# Altium project bms_mainboard-1_1.PrjPcb (part 4 of 8)

## Sheet conn_fan.SchDoc
size A
Used 2 times, as channels fan0, fan1. Parts and nets are listed once, with the designators drawn on the sheet.
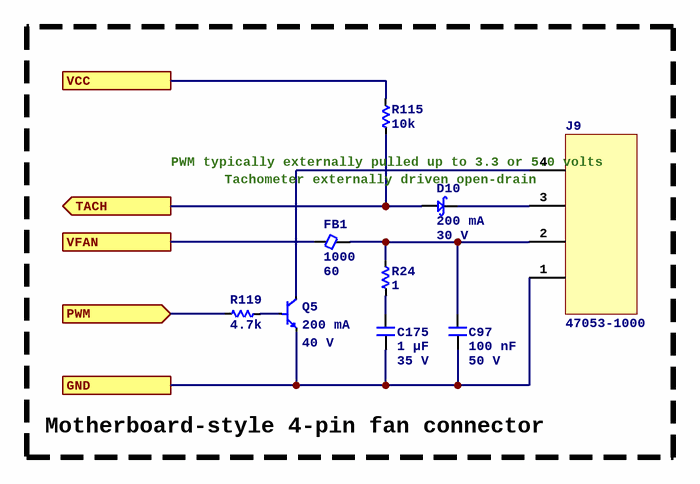
[diagram p19: conn_fan.SchDoc]

### Parts
C97  Capacitance: 100 nF  Voltage Rating: 50 V  [C0402]  (hidden comment: CL05B104KB54PNC)
C175  Capacitance: 1 µF  Voltage Rating: 35 V  [C0603]  (hidden comment: GMK107AB7105KAHT)
D10  Current: 200 mA  Vr: 30 V  [SOD523]  (hidden comment: BAT54XV2T1G)
FB1  Current Rating (mA): 1000  Z @ 100 MHz: 60  [FB0805]  (hidden comment: MGGB2012M600HT-LF)
J9  47053-1000  [MOLEX_KK254_4POS_VERT_0470531000]
Q5  Current: 200 mA  Voltage: 40 V  [3SOT523]  (hidden comment: MMBT3904T)
R24  value 1  [R0402]  (hidden comment: CRCW04021R00FKEDC)
R115  value 10k  [R0402]  (hidden comment: 0402WGF1002TCE)
R119  value 4.7k  [R0402]  (hidden comment: 0402WGF4701TCE)

### Ports
GND, PWM (in), TACH (out), VCC, VFAN

### Nets
GND: C97.2 C175.2 J9.1 Q5.2(E) ; port GND
PWM: R119.2 ; port PWM
TACH: D10.1 R115.2 ; port TACH
VCC: R115.1 ; port VCC
VFAN: FB1.1 ; port VFAN
NetC97_1: C97.1 FB1.2 J9.2 R24.2
NetC175_1: C175.1 R24.1
NetD10_2: D10.2 J9.3
NetJ9_4: J9.4 Q5.3(C)
NetQ5_1: Q5.1(B) R119.1

### Channels
fan0: designators end in A; ports GND=GND PWM=FAN1_PWM TACH=FAN1_TACH VCC=3P3 VFAN=LV2
fan1: designators end in B; ports GND=GND PWM=FAN2_PWM TACH=FAN2_TACH VCC=3P3 VFAN=LV2

### Notes on the sheet
- PWM typically externally pulled up to 3.3 or 5.0 volts
- (near D10) Tachometer externally driven open-drain
- Motherboard-style 4-pin fan connector

### Library data of the parts
C97 = CL05B104KB54PNC: Manufacturer: Samsung Electro-Mechanics; Dielectric: X7R; ComponentLink1URL: https://wmsc.lcsc.com/wmsc/upload/file/pdf/v2/lcsc/2304140030_Samsung-Electro-Mechanics-CL05B104KB54PNC_C307331.pdf; ComponentLink1Description: Datasheet; Manufacturer Part Number: CL05B104KB54PNC; Package: 0402; Supplier 2: LCSC; Supplier Part Number 2: C307331
C175 = GMK107AB7105KAHT: Manufacturer: Taiyo Yuden; Dielectric: X7R; ComponentLink1URL: https://datasheet.lcsc.com/lcsc/2304140030_Taiyo-Yuden-GMK107AB7105KAHT_C841050.pdf; ComponentLink1Description: Datasheet; Manufacturer Part Number: GMK107AB7105KAHT; Package: 0603; Supplier 2: LCSC; Supplier Part Number 2: C841050
D10 = BAT54XV2T1G: ON Semi BAT54XV2T1G; SMT Schottky Diode; 30V 200mA; 5ns; 2-Pin SOD-523; Manufacturer: onsemi; Supplier 1: DigiKey; Supplier Part Number 1: BAT54XV2T1GOSCT-ND; Manufacturer Part Number: BAT54XV2T1G; Supplier 2: LCSC; Supplier Part Number 2: C81572; ComponentLink1Description: Datasheet; ComponentLink1URL: https://www.onsemi.com/pdf/datasheet/bat54xv2t1-d.pdf; Diode Type: Schottky; Supplier 3: Mouser; Supplier Part Number 3: 863-BAT54XV2T1G
FB1 = MGGB2012M600HT-LF: Manufacturer: microgate; DCR (mOhms): 50; ComponentLink1URL: https://wmsc.lcsc.com/wmsc/upload/file/pdf/v2/lcsc/2304140030_microgate-MGGB2012M600HT-LF_C281169.pdf; ComponentLink1Description: Datasheet; Manufacturer Part Number: MGGB2012M600HT-LF; Package: 0805; Supplier 2: LCSC; Supplier Part Number 2: C281169
J9 = 47053-1000: Board Connector, 4 Contact(s), 1 Row(s), Male, Straight, 0.1 inch Pitch, Solder Terminal, Locking, White Insulator, Receptacle; Manufacturer: Molex; Supplier 1: DigiKey; Supplier Part Number 1: WM4330-ND; Manufacturer Part Number: 47053-1000; ComponentLink1URL: https://www.molex.com/content/dam/molex/molex-dot-com/products/automated/en-us/salesdrawingpdf/470/47053/470531000_sd.pdf?inline; ComponentLink1Description: Drawing; ComponentLink2Description: Product page; ComponentLink2URL: https://www.molex.com/en-us/products/part-detail/470531000; Supplier 2: LCSC; Supplier Part Number 2: C240840; Supplier 3: Mouser; Supplier Part Number 3: 538-47053-1000
Q5 = MMBT3904T: Bipolar (BJT) Transistor NPN 40 V 200 mA 300MHz 150 mW Surface Mount SOT-523; Manufacturer: Shenzhen Slkormicro Semicon Co., Ltd.; Supplier 1: DigiKey; Supplier Part Number 1: 5399-MMBT3904TCT-ND; Manufacturer Part Number: MMBT3904T; ComponentLink1Description: Datasheet; ComponentLink1URL: https://mm.digikey.com/Volume0/opasdata/d220001/medias/docus/7136/5399_MMBT3904T%20SOT-523.pdf; Supplier 2: LCSC; Supplier Part Number 2: C61616; Polarity: NPN
R24 = CRCW04021R00FKEDC: Manufacturer: Vishay Intertech; Tolerance: 1%; Temperature Coefficient: ±100ppm/?; Power Rating (mW): 62.5; ComponentLink1Description: Datasheet; ComponentLink1URL: https://datasheet.lcsc.com/lcsc/2304140030_Vishay-Intertech-CRCW04021R00FKEDC_C2077765.pdf; Manufacturer Part Number: CRCW04021R00FKEDC; Package: 0402; Supplier 2: LCSC; Supplier Part Number 2: C2077765
R115 = 0402WGF1002TCE: Manufacturer: UNI-ROYAL(Uniroyal Elec); Tolerance: 1%; Temperature Coefficient: ±100ppm/?; Power Rating (mW): 62.5; ComponentLink1Description: Datasheet; ComponentLink1URL: https://wmsc.lcsc.com/wmsc/upload/file/pdf/v2/lcsc/2206010100_UNI-ROYAL-Uniroyal-Elec-0402WGF1002TCE_C25744.pdf; Manufacturer Part Number: 0402WGF1002TCE; Package: 0402; Supplier 2: LCSC; Supplier Part Number 2: C25744
R119 = 0402WGF4701TCE: Manufacturer: UNI-ROYAL(Uniroyal Elec); Tolerance: 1%; Temperature Coefficient: ±100ppm/?; Power Rating (mW): 62.5; ComponentLink1Description: Datasheet; ComponentLink1URL: https://wmsc.lcsc.com/wmsc/upload/file/pdf/v2/lcsc/2206010045_UNI-ROYAL-Uniroyal-Elec-0402WGF4701TCE_C25900.pdf; Manufacturer Part Number: 0402WGF4701TCE; Package: 0402; Supplier 2: LCSC; Supplier Part Number 2: C25900

## Sheet hv_bleed.SchDoc
size A
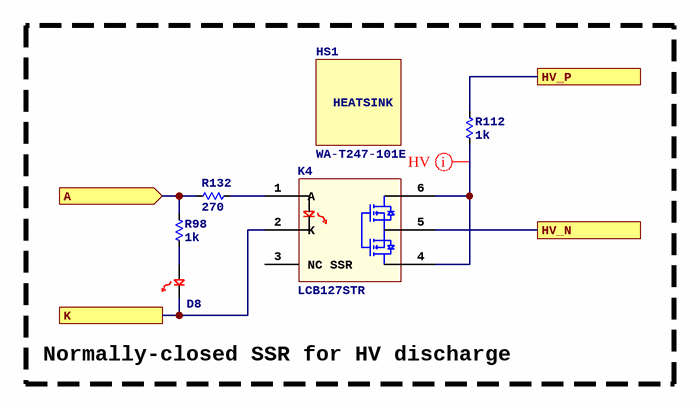
[diagram p20: hv_bleed.SchDoc]

### Parts
D8  LTST-C190KRKT  [LED_0603P_RED]  (value not drawn)
HS1  WA-T247-101E  [OHMITE_WA-T247-101E]
K4  LCB127STR  [6SMD300]
R98  value 1k  [R0402]  (hidden comment: 0402WGF1001TCE)
R112  value 1k  [TO-247-2_VERTICAL]  (hidden comment: TEH100M1K00JE)
R132  value 270  [R0402]  (hidden comment: 0402WGF2700TCE)

### Blocks framed on the sheet
Normally-closed SSR for HV discharge: D8 HS1 K4 R98 R112 R132

### Ports
A (in), HV_N, HV_P, K

### Nets
GND: D8.2 K4.2(K) ; port K
HV_N: K4.5 ; port HV_N
HV_P: R112.2 ; port HV_P
HV_nBLEED: R98.1 R132.2 ; port A
NetD8_1: D8.1 R98.2
NetK4_1: K4.1(A) R132.1
NetK4_4: K4.4 K4.6 R112.1

Not connected (* = marked no-connect by the designer): K4 3

### Layout directives
net class HV: NetK4_4

### Notes on the sheet
- (in symbol LCB127STR) NC SSR
- (in symbol WA-T247-101E) HEATSINK

### Library data of the parts
D8 = LTST-C190KRKT: LED SUPER RED CLEAR 0603 SMD; Manufacturer: Lite-On Inc; Vf: 2.0 V; If: 20 mA; Supplier 1: DigiKey; ComponentLink1URL: https://optoelectronics.liteon.com/upload/download/DS-22-99-0151/LTST-C190KRKT.pdf; ComponentLink1Description: Datasheet; Supplier Part Number 1: 160-1436-1-ND; Manufacturer Part Number: LTST-C190KRKT; Supplier 2: LCSC; Supplier Part Number 2: C94869; LED Color: Red; Supplier 3: Mouser; Supplier Part Number 3: 859-LTST-C190KRKT
HS1 = WA-T247-101E: Heat Sink, 11ohm, Extruded, Clip, Longitudinal, Aluminum Alloy, Anodized; Manufacturer: Ohmite; Supplier 1: DigiKey; Supplier Part Number 1: WA-T247-101E-ND; Manufacturer Part Number: WA-T247-101E; ComponentLink1Description: Datasheet; ComponentLink1URL: https://www.ohmite.com/assets/images/sink-w.pdf; Supplier 3: Mouser; Supplier Part Number 3: 588-WA-T247-101E
K4 = LCB127STR: Relay Ssr 50MA 1.4V Dc-in 0.2A 250V Ac/dc-out 6-PIN PDIP SMD T/r; Manufacturer: IXYS; Supplier 1: DigiKey; Supplier Part Number 1: 212-LCB127STRCT-ND; Manufacturer Part Number: LCB127STR; ComponentLink1Description: Datasheet; ComponentLink1URL: https://www.littelfuse.com/assetdocs/littelfuse-integrated-circuits-lcb127-datasheet?assetguid=ed9c03ce-9d8a-4952-b2f0-cdedc4b0af1f; Supplier 2: LCSC; Supplier Part Number 2: C6286119; Supplier 3: Mouser; Supplier Part Number 3: 849-LCB127STR
R98 = 0402WGF1001TCE: Manufacturer: UNI-ROYAL(Uniroyal Elec); Tolerance: 1%; Temperature Coefficient: ±100ppm/?; Power Rating (mW): 62.5; ComponentLink1Description: Datasheet; ComponentLink1URL: https://wmsc.lcsc.com/wmsc/upload/file/pdf/v2/lcsc/2206010216_UNI-ROYAL-Uniroyal-Elec-0402WGF1001TCE_C11702.pdf; Manufacturer Part Number: 0402WGF1001TCE; Package: 0402; Supplier 2: LCSC; Supplier Part Number 2: C11702
R112 = TEH100M1K00JE: Manufacturer: Ohmite; Tolerance: 5%; Power Rating (mW): 100000; Supplier 1: DigiKey; Manufacturer Part Number: TEH100M1K00JE; ComponentLink1URL: http://www.ohmite.com/cat/res_teh100.pdf; ComponentLink1Description: Datasheet; Supplier Part Number 1: TEH100M1K00JE-ND; Supplier 2: LCSC; Supplier Part Number 2: C2642397; Package: TO-247
R132 = 0402WGF2700TCE: Manufacturer: UNI-ROYAL(Uniroyal Elec); Tolerance: 1%; Temperature Coefficient: ±100ppm/?; Power Rating (mW): 62.5; ComponentLink1Description: Datasheet; ComponentLink1URL: https://wmsc.lcsc.com/wmsc/upload/file/pdf/v2/lcsc/2205311900_UNI-ROYAL-Uniroyal-Elec-0402WGF2700TCE_C25099.pdf; Manufacturer Part Number: 0402WGF2700TCE; Package: 0402; Supplier 2: LCSC; Supplier Part Number 2: C25099

## Sheet current_mp6519.SchDoc
size A
Used 3 times, as channels current_coil_hs, current_coil_ls, current_coil_pc. Parts and nets are listed once, with the designators drawn on the sheet.
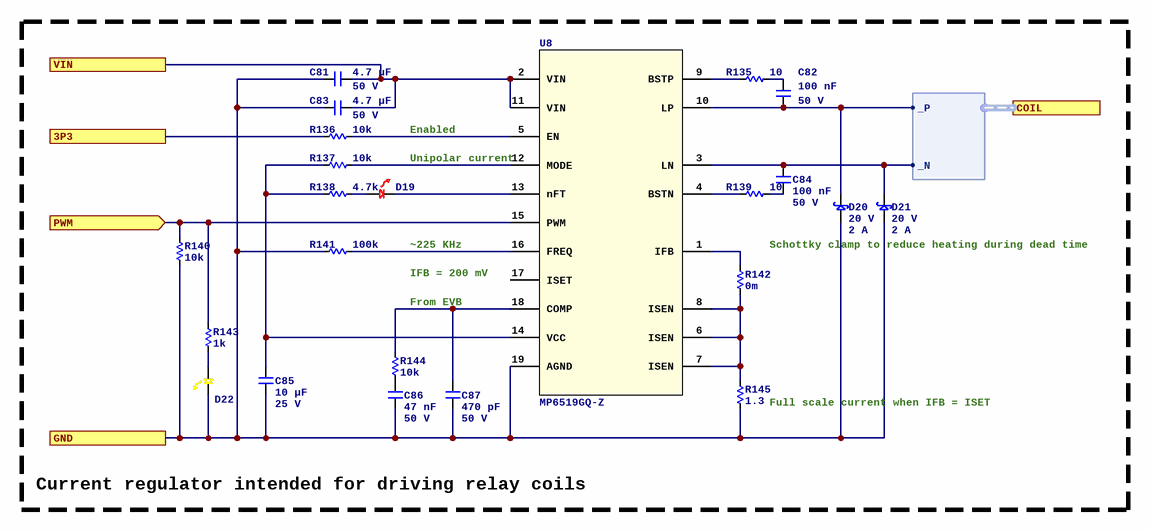
[diagram p21: current_mp6519.SchDoc]

### Parts
C81  Capacitance: 4.7 µF  Voltage Rating: 50 V  [C0805]  (hidden comment: 0805B475K500NT)
C82  Capacitance: 100 nF  Voltage Rating: 50 V  [C0402]  (hidden comment: CL05B104KB54PNC)
C83  Capacitance: 4.7 µF  Voltage Rating: 50 V  [C0805]  (hidden comment: 0805B475K500NT)
C84  Capacitance: 100 nF  Voltage Rating: 50 V  [C0402]  (hidden comment: CL05B104KB54PNC)
C85  Capacitance: 10 µF  Voltage Rating: 25 V  [C0603]  (hidden comment: CL10A106MA8NRNC)
C86  Capacitance: 47 nF  Voltage Rating: 50 V  [C0402]  (hidden comment: 0402B473K500NT)
C87  Capacitance: 470 pF  Voltage Rating: 50 V  [C0402]  (hidden comment: GRM1555C1H471JA01D)
D19  LTST-C190KRKT  [LED_0603P_RED]  (value not drawn)
D20  Vr: 20 V  Current: 2 A  [ESMP]  (hidden comment: MSS2P2-M3/89A)
D21  Vr: 20 V  Current: 2 A  [ESMP]  (hidden comment: MSS2P2-M3/89A)
D22  LTST-C190YKT  [LED_0603P_YELLOW]  (value not drawn)
R135  value 10  [R0402]  (hidden comment: FRC0402F10R0TS)
R136  value 10k  [R0402]  (hidden comment: 0402WGF1002TCE)
R137  value 10k  [R0402]  (hidden comment: 0402WGF1002TCE)
R138  value 4.7k  [R0402]  (hidden comment: 0402WGF4701TCE)
R139  value 10  [R0402]  (hidden comment: FRC0402F10R0TS)
R140  value 10k  [R0402]  (hidden comment: 0402WGF1002TCE)
R141  value 100k  [R0402]  (hidden comment: 0402WGF1003TCE)
R142  value 0m  [R0402]  (hidden comment: 0402WGF0000TCE)
R143  value 1k  [R0402]  (hidden comment: 0402WGF1001TCE)
R144  value 10k  [R0402]  (hidden comment: 0402WGF1002TCE)
R145  value 1.3  [R1206]  (hidden comment: HP06W2F130KT5E)
U8  MP6519GQ-Z  [MP6519]

### Ports
3P3, COIL (harness DIFF), GND, PWM (in), VIN

### Harnesses
DIFF: _N, _P

### Nets
3P3: R136.1 ; port 3P3
GND: C81.1 C83.1 C85.2 C86.2 C87.2 D20.1 D21.1 D22.2 R140.1 R141.2 R145.1 U8.19(AGND) ; port GND
PWM: R140.2 R143.1 U8.15(PWM) ; port PWM
VIN: C81.2 C83.2 U8.2(VIN) U8.11(VIN) ; port VIN
NetC82_1: C82.1 R135.2
NetC82_2: C82.2 D20.2 U8.10(LP) ; port COIL._P
NetC84_1: C84.1 D21.2 U8.3(LN) ; port COIL._N
NetC84_2: C84.2 R139.2
NetC85_1: C85.1 R137.1 R138.1 U8.14(VCC)
NetC86_1: C86.1 R144.1
NetC87_1: C87.1 R144.2 U8.18(COMP)
NetD19_1: D19.1 R138.2
NetD19_2: D19.2 U8.13(nFT)
NetD22_1: D22.1 R143.2
NetR135_1: R135.1 U8.9(BSTP)
NetR136_2: R136.2 U8.5(EN)
NetR137_2: R137.2 U8.12(MODE)
NetR139_1: R139.1 U8.4(BSTN)
NetR141_1: R141.1 U8.16(FREQ)
NetR142_1: R142.1 R145.2 U8.6(ISEN) U8.7(ISEN) U8.8(ISEN)
NetR142_2: R142.2 U8.1(IFB)

Not connected (* = marked no-connect by the designer): U8 17(ISET)

### Channels
current_coil_hs: designators end in A; ports 3P3=3P3 GND=GND PWM=HIGHSIDE_CONTACTOR VIN=LV1
current_coil_ls: designators end in B; ports 3P3=3P3 GND=GND PWM=LOWSIDE_CONTACTOR VIN=LV1
current_coil_pc: designators end in C; ports 3P3=3P3 GND=GND PWM=PRECHARGE_CONTACTOR VIN=LV1

### Notes on the sheet
- Enabled
- Unipolar current
- ~225 KHz
- IFB = 200 mV
- Schottky clamp to reduce heating during dead time
- From EVB
- (near R145) Full scale current when IFB = ISET
- Current regulator intended for driving relay coils

### Library data of the parts
C81 C83 = 0805B475K500NT: Manufacturer: FH (Guangdong Fenghua Advanced Tech); Dielectric: X7R; ComponentLink1URL: https://wmsc.lcsc.com/wmsc/upload/file/pdf/v2/lcsc/2204111630_FH--Guangdong-Fenghua-Advanced-Tech-0805B475K500NT_C2991173.pdf; ComponentLink1Description: Datasheet; Manufacturer Part Number: 0805B475K500NT; Package: 0805; Supplier 2: LCSC; Supplier Part Number 2: C2991173
C82 C84 = CL05B104KB54PNC: as C97 on sheet conn_fan; ComponentLink1URL: https://wmsc.lcsc.com/wmsc/upload/file/pdf/v2/lcsc/2304140030_Samsung-Electro-Mechanics-CL05B104KB54PNC_C307331.pdf; ComponentLink1Description: Datasheet; Manufacturer Part Number: CL05B104KB54PNC; Package: 0402; Supplier 2: LCSC; Supplier Part Number 2: C307331
C85 = CL10A106MA8NRNC: Manufacturer: Samsung Electro-Mechanics; Dielectric: X5R; ComponentLink1URL: https://wmsc.lcsc.com/wmsc/upload/file/pdf/v2/lcsc/2304140030_Samsung-Electro-Mechanics-CL10A106MA8NRNC_C96446.pdf; ComponentLink1Description: Datasheet; Manufacturer Part Number: CL10A106MA8NRNC; Package: 0603; Supplier 2: LCSC; Supplier Part Number 2: C96446
C86 = 0402B473K500NT: Manufacturer: FH(Guangdong Fenghua Advanced Tech); Dielectric: X7R; ComponentLink1URL: https://wmsc.lcsc.com/wmsc/upload/file/pdf/v2/lcsc/2304140030_FH--Guangdong-Fenghua-Advanced-Tech-0402B473K500NT_C82219.pdf; ComponentLink1Description: Datasheet; Manufacturer Part Number: 0402B473K500NT; Package: 0402; Supplier 2: LCSC; Supplier Part Number 2: C82219
C87 = GRM1555C1H471JA01D: Manufacturer: Murata Electronics; Dielectric: C0G; ComponentLink1URL: https://wmsc.lcsc.com/wmsc/upload/file/pdf/v2/lcsc/1811081616_Murata-Electronics-GRM1555C1H471JA01D_C76971.pdf; ComponentLink1Description: Datasheet; Manufacturer Part Number: GRM1555C1H471JA01D; Package: 0402; Supplier 2: LCSC; Supplier Part Number 2: C76971
D19 = LTST-C190KRKT: as D8 on sheet hv_bleed; ComponentLink1URL: https://optoelectronics.liteon.com/upload/download/DS-22-99-0151/LTST-C190KRKT.pdf; ComponentLink1Description: Datasheet; Supplier 1: DigiKey; Supplier Part Number 1: 160-1436-1-ND; Manufacturer Part Number: LTST-C190KRKT; Supplier 2: LCSC; Supplier Part Number 2: C94869; LED Color: Red; Supplier 3: Mouser; Supplier Part Number 3: 859-LTST-C190KRKT
D20 D21 = MSS2P2-M3/89A: DIODE SCHOTTKY 20V 2A MICROSMP; Manufacturer: Vishay Semiconductor Diodes Division; Supplier 1: DigiKey; Manufacturer Part Number: MSS2P2-M3/89A; ComponentLink1URL: http://www.vishay.com/docs/89054/mss2p3.pdf; ComponentLink1Description: Datasheet; Supplier Part Number 1: MSS2P2-M3/89AGICT-ND; Supplier 2: LCSC; Supplier Part Number 2: C2978531; Diode Type: Schottky; Supplier 3: Mouser; Supplier Part Number 3: 625-MSS2P2-M3
D22 = LTST-C190YKT: LED YELLOW CLEAR 0603 SMD; Manufacturer: Lite-On Inc; Vf: 2.1 V; If: 20 mA; Supplier 1: DigiKey; ComponentLink1URL: https://mm.digikey.com/Volume0/opasdata/d220001/medias/docus/1176/LTST-C190YKT.pdf; ComponentLink1Description: Datasheet; Supplier Part Number 1: 160-1184-1-ND; Manufacturer Part Number: LTST-C190YKT; Supplier 2: LCSC; Supplier Part Number 2: C125097; LED Color: Yellow; Supplier 3: Mouser; Supplier Part Number 3: 859-LTST-C190YKT
R135 R139 = FRC0402F10R0TS: Manufacturer: FOJAN; Tolerance: 1%; Temperature Coefficient: ±100ppm/?; Power Rating (mW): 62.5; ComponentLink1Description: Datasheet; ComponentLink1URL: https://datasheet.lcsc.com/lcsc/2308241947_FOJAN-FRC0402F10R0TS_C2906862.pdf; Manufacturer Part Number: FRC0402F10R0TS; Package: 0402; Supplier 2: LCSC; Supplier Part Number 2: C2906862
R136 R137 R140 R144 = 0402WGF1002TCE: as R115 on sheet conn_fan; ComponentLink1Description: Datasheet; ComponentLink1URL: https://wmsc.lcsc.com/wmsc/upload/file/pdf/v2/lcsc/2206010100_UNI-ROYAL-Uniroyal-Elec-0402WGF1002TCE_C25744.pdf; Manufacturer Part Number: 0402WGF1002TCE; Package: 0402; Supplier 2: LCSC; Supplier Part Number 2: C25744
R138 = 0402WGF4701TCE: as R119 on sheet conn_fan; ComponentLink1Description: Datasheet; ComponentLink1URL: https://wmsc.lcsc.com/wmsc/upload/file/pdf/v2/lcsc/2206010045_UNI-ROYAL-Uniroyal-Elec-0402WGF4701TCE_C25900.pdf; Manufacturer Part Number: 0402WGF4701TCE; Package: 0402; Supplier 2: LCSC; Supplier Part Number 2: C25900
R141 = 0402WGF1003TCE: Manufacturer: UNI-ROYAL(Uniroyal Elec); Tolerance: 1%; Temperature Coefficient: ±100ppm/?; Power Rating (mW): 62.5; ComponentLink1Description: Datasheet; ComponentLink1URL: https://wmsc.lcsc.com/wmsc/upload/file/pdf/v2/lcsc/2206010100_UNI-ROYAL-Uniroyal-Elec-0402WGF1003TCE_C25741.pdf; Manufacturer Part Number: 0402WGF1003TCE; Package: 0402; Supplier 2: LCSC; Supplier Part Number 2: C25741
R142 = 0402WGF0000TCE: Manufacturer: UNI-ROYAL(Uniroyal Elec); Power Rating (mW): 62.5; ComponentLink1Description: Datasheet; ComponentLink1URL: https://wmsc.lcsc.com/wmsc/upload/file/pdf/v2/lcsc/2206010216_UNI-ROYAL-Uniroyal-Elec-0402WGF0000TCE_C17168.pdf; Manufacturer Part Number: 0402WGF0000TCE; Package: 0402; Supplier 2: LCSC; Supplier Part Number 2: C17168
R143 = 0402WGF1001TCE: as R98 on sheet hv_bleed; ComponentLink1Description: Datasheet; ComponentLink1URL: https://wmsc.lcsc.com/wmsc/upload/file/pdf/v2/lcsc/2206010216_UNI-ROYAL-Uniroyal-Elec-0402WGF1001TCE_C11702.pdf; Manufacturer Part Number: 0402WGF1001TCE; Package: 0402; Supplier 2: LCSC; Supplier Part Number 2: C11702
R145 = HP06W2F130KT5E: Manufacturer: UNI-ROYAL(Uniroyal Elec); Tolerance: 1%; Temperature Coefficient: ±100ppm/?; Power Rating (mW): 500; ComponentLink1Description: Datasheet; ComponentLink1URL: https://wmsc.lcsc.com/wmsc/upload/file/pdf/v2/lcsc/2304140030_UNI-ROYAL-Uniroyal-Elec-HP06W2F130KT5E_C414957.pdf; Manufacturer Part Number: HP06W2F130KT5E; Package: 1206; Supplier 2: LCSC; Supplier Part Number 2: C414957
U8 = MP6519GQ-Z: 2.5V - 28V, 5A, H-bridge Current Regulator; Manufacturer: Monolithic Power Systems; Supplier 1: DigiKey; Supplier Part Number 1: 1589-2044-1-ND; Manufacturer Part Number: MP6519GQ-Z; ComponentLink1Description: Datasheet; ComponentLink1URL: https://mm.digikey.com/Volume0/opasdata/d220001/medias/docus/696/MP6519_r1.01.pdf; Supplier 3: JLCPCB; Supplier Part Number 3: C2762181

## Sheet pmic_cincon_brick.SchDoc
size A
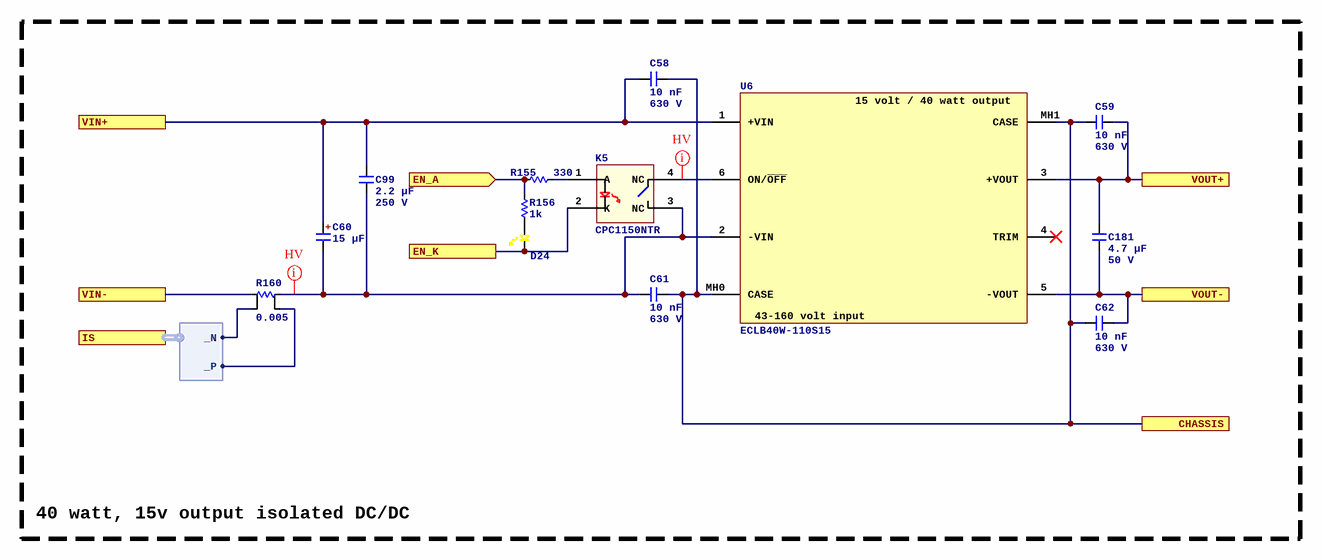
[diagram p22: pmic_cincon_brick.SchDoc]

### Parts
C58  Capacitance: 10 nF  Voltage Rating: 630 V  [KEMET_R75_40x90x130x100]  (hidden comment: R75PF21004030J)
C59  Capacitance: 10 nF  Voltage Rating: 630 V  [KEMET_R75_40x90x130x100]  (hidden comment: R75PF21004030J)
C60  Capacitance: 15 µF  [KEMET_MS_10X12]  (hidden comment: A759MS156M2CAAE094)
C61  Capacitance: 10 nF  Voltage Rating: 630 V  [KEMET_R75_40x90x130x100]  (hidden comment: R75PF21004030J)
C62  Capacitance: 10 nF  Voltage Rating: 630 V  [KEMET_R75_40x90x130x100]  (hidden comment: R75PF21004030J)
C99  Capacitance: 2.2 µF  Voltage Rating: 250 V  [C2220]  (hidden comment: C5750X7T2E225KT000N)
C181  Capacitance: 4.7 µF  Voltage Rating: 50 V  [C0805]  (hidden comment: 0805B475K500NT)
D24  LTST-C190YKT  [LED_0603P_YELLOW]  (value not drawn)
K5  CPC1150NTR  [4SMD300]
R155  value 330  [R0402]  (hidden comment: 0402WGD3300TCE)
R156  value 1k  [R0402]  (hidden comment: 0402WGF1001TCE)
R160  value 0.005  [VISHAY_WSL2726]  (hidden comment: WSL27265L000FEB)
U6  ECLB40W-110S15  [CINCON_ECLB]

### Blocks framed on the sheet
40 watt, 15v output isolated DC/DC: C58-C62 C99 C181 D24 K5 R155 R156 R160 U6

### Ports
CHASSIS, EN_A (in), EN_K, IS (harness DIFF), VIN+, VIN-, VOUT+, VOUT-

### Harnesses
DIFF: _P, _N

### Nets
15P0: C59.2 C181.1 U6.3(+VOUT) ; port VOUT+
CHASSIS: C58.2 C59.1 C61.2 C62.1 U6.MH0(CASE) U6.MH1(CASE) ; port CHASSIS
GND: C62.2 C181.2 D24.2 K5.2(K) U6.5(-VOUT) ; port EN_K, port VOUT-
HV_N: R160.1 ; port VIN-
HV_P: C58.1 C60.1 C99.1 U6.1(+VIN) ; port VIN+
DCDC_IS._N: R160.3 ; port IS._N
DCDC_IS._P: R160.4 ; port IS._P
HV_DCDC_EN: R155.2 R156.1 ; port EN_A
NetC60_2: C60.2 C61.1 C99.2 K5.3(NC) R160.2 U6.2(-VIN)
NetD24_1: D24.1 R156.2
NetK5_1: K5.1(A) R155.1
NetK5_4: K5.4(NC) U6.6(ON/~{OFF})

Not connected (* = marked no-connect by the designer): U6 4(TRIM)*

### Layout directives
net class HV: NetC60_2, NetK5_4

### Notes on the sheet
- (in symbol A759MS156M2CAAE094) +
- (in symbol ECLB40W-110S15) 15 volt / 40 watt output; 43-160 volt input

### Library data of the parts
C58 C59 C61 C62 = R75PF21004030J: Radial metallized polypropylene capacitor, 10 nF, 630 V; Manufacturer: KEMET; Manufacturer Part Number: R75PF21004030J; Supplier 2: LCSC; Supplier Part Number 2: C3796255; Supplier 1: DigiKey; Supplier Part Number 1: 399-12754-ND; Dielectric: Polypropylene; Supplier 3: Mouser; Supplier Part Number 3: 80-R75PF21004030J; ComponentLink1Description: Datasheet; ComponentLink1URL: https://yageogroup.com/content/datasheet/asset/file/KEM_F3106_R75
C60 = A759MS156M2CAAE094: Radial aluminum polymer capacitor, 15 µF, 160 V; Manufacturer: KEMET; Voltage Rating: 160 V; Manufacturer Part Number: A759MS156M2CAAE094; Supplier 1: DigiKey; Supplier Part Number 1: 399-14160-ND; Supplier 2: LCSC; Supplier Part Number 2: C599551; ComponentLink1Description: Datasheet; ComponentLink1URL: https://yageogroup.com/content/datasheet/asset/file/KEM_A4072_A759; Type: Aluminum Polymer; Supplier 3: Mouser; Supplier Part Number 3: 80-A759MS156M2CAAE94
C99 = C5750X7T2E225KT000N: Manufacturer: TDK; Dielectric: X7T; ComponentLink1URL: https://wmsc.lcsc.com/wmsc/upload/file/pdf/v2/lcsc/2304140030_TDK-C5750X7T2E225KT000N_C435266.pdf; ComponentLink1Description: Datasheet; Manufacturer Part Number: C5750X7T2E225KT000N; Package: 2220; Supplier 2: LCSC; Supplier Part Number 2: C435266
C181 = 0805B475K500NT: as C81 on sheet current_mp6519; ComponentLink1URL: https://wmsc.lcsc.com/wmsc/upload/file/pdf/v2/lcsc/2204111630_FH--Guangdong-Fenghua-Advanced-Tech-0805B475K500NT_C2991173.pdf; ComponentLink1Description: Datasheet; Manufacturer Part Number: 0805B475K500NT; Package: 0805; Supplier 2: LCSC; Supplier Part Number 2: C2991173
D24 = LTST-C190YKT: as D22 on sheet current_mp6519; Supplier 1: DigiKey; ComponentLink1URL: https://mm.digikey.com/Volume0/opasdata/d220001/medias/docus/1176/LTST-C190YKT.pdf; ComponentLink1Description: Datasheet; Supplier Part Number 1: 160-1184-1-ND; Manufacturer Part Number: LTST-C190YKT; Supplier 2: LCSC; Supplier Part Number 2: C125097; LED Color: Yellow; Supplier 3: Mouser; Supplier Part Number 3: 859-LTST-C190YKT
K5 = CPC1150NTR: CPC1150N Series SPST 120 mA 350 V Single Channel Solid State Relay SMT - SOIC-4; Manufacturer: Littelfuse; Supplier 1: DigiKey; Supplier Part Number 1: 5656-CPC1150NTRCT-ND; Manufacturer Part Number: CPC1150NTR; ComponentLink1URL: https://www.littelfuse.com/media?resourcetype=datasheets&itemid=7f3e9a05-5c4a-493e-bfe5-2075df32c7f9&filename=littelfuse-integrated-circuits-cpc1150n-series-datasheet; ComponentLink1Description: Datasheet; Supplier 2: LCSC; Supplier Part Number 2: C5299824; Supplier 3: Mouser; Supplier Part Number 3: 849-CPC1150NTR
R155 = 0402WGD3300TCE: Manufacturer: UNI-ROYAL(Uniroyal Elec); Tolerance: 0.5%; Temperature Coefficient: ±100ppm/?; Power Rating (mW): 62.5; ComponentLink1Description: Datasheet; ComponentLink1URL: https://wmsc.lcsc.com/wmsc/upload/file/pdf/v2/lcsc/2411221126_UNI-ROYAL-Uniroyal-Elec-0402WGD3300TCE_C423288.pdf; Manufacturer Part Number: 0402WGD3300TCE; Package: 0402; Supplier 2: LCSC; Supplier Part Number 2: C423288
R156 = 0402WGF1001TCE: as R98 on sheet hv_bleed; ComponentLink1Description: Datasheet; ComponentLink1URL: https://wmsc.lcsc.com/wmsc/upload/file/pdf/v2/lcsc/2206010216_UNI-ROYAL-Uniroyal-Elec-0402WGF1001TCE_C11702.pdf; Manufacturer Part Number: 0402WGF1001TCE; Package: 0402; Supplier 2: LCSC; Supplier Part Number 2: C11702
R160 = WSL27265L000FEB: Manufacturer: Vishay Dale; Tolerance: 1%; Power Rating (mW): 3000; Supplier 1: DigiKey; Manufacturer Part Number: WSL27265L000FEB; ComponentLink1URL: http://www.vishay.com/docs/30131/wsl2726.pdf; ComponentLink1Description: Datasheet; Supplier Part Number 1: WSLQ-.005CT-ND; Supplier 2: LCSC; Supplier Part Number 2: C1517421; Package: 2726
U6 = ECLB40W-110S15: Isolated Module DC DC Converter 1 Output 15V 2.666A 43V - 160V Input; Manufacturer: Cincon Electronics Co. LTD; Supplier 1: DigiKey; Supplier Part Number 1: 2034-3307-ND; Supplier 2: LCSC; Supplier Part Number 2: C5726884; Manufacturer Part Number: ECLB40W-110S15; ComponentLink1Description: Datasheet; ComponentLink1URL: https://www.cincon.com/productdownload/Datasheet-ECLB40W-110-series.pdf; ComponentLink2Description: Application Note; ComponentLink2URL: https://www.cincon.com/productdownload/ECLB40W-110-series-application-note.pdf; Supplier 3: Mouser; Supplier Part Number 3: 418-ECLB40110S15

## Sheet usb_usb2534.SchDoc
size B
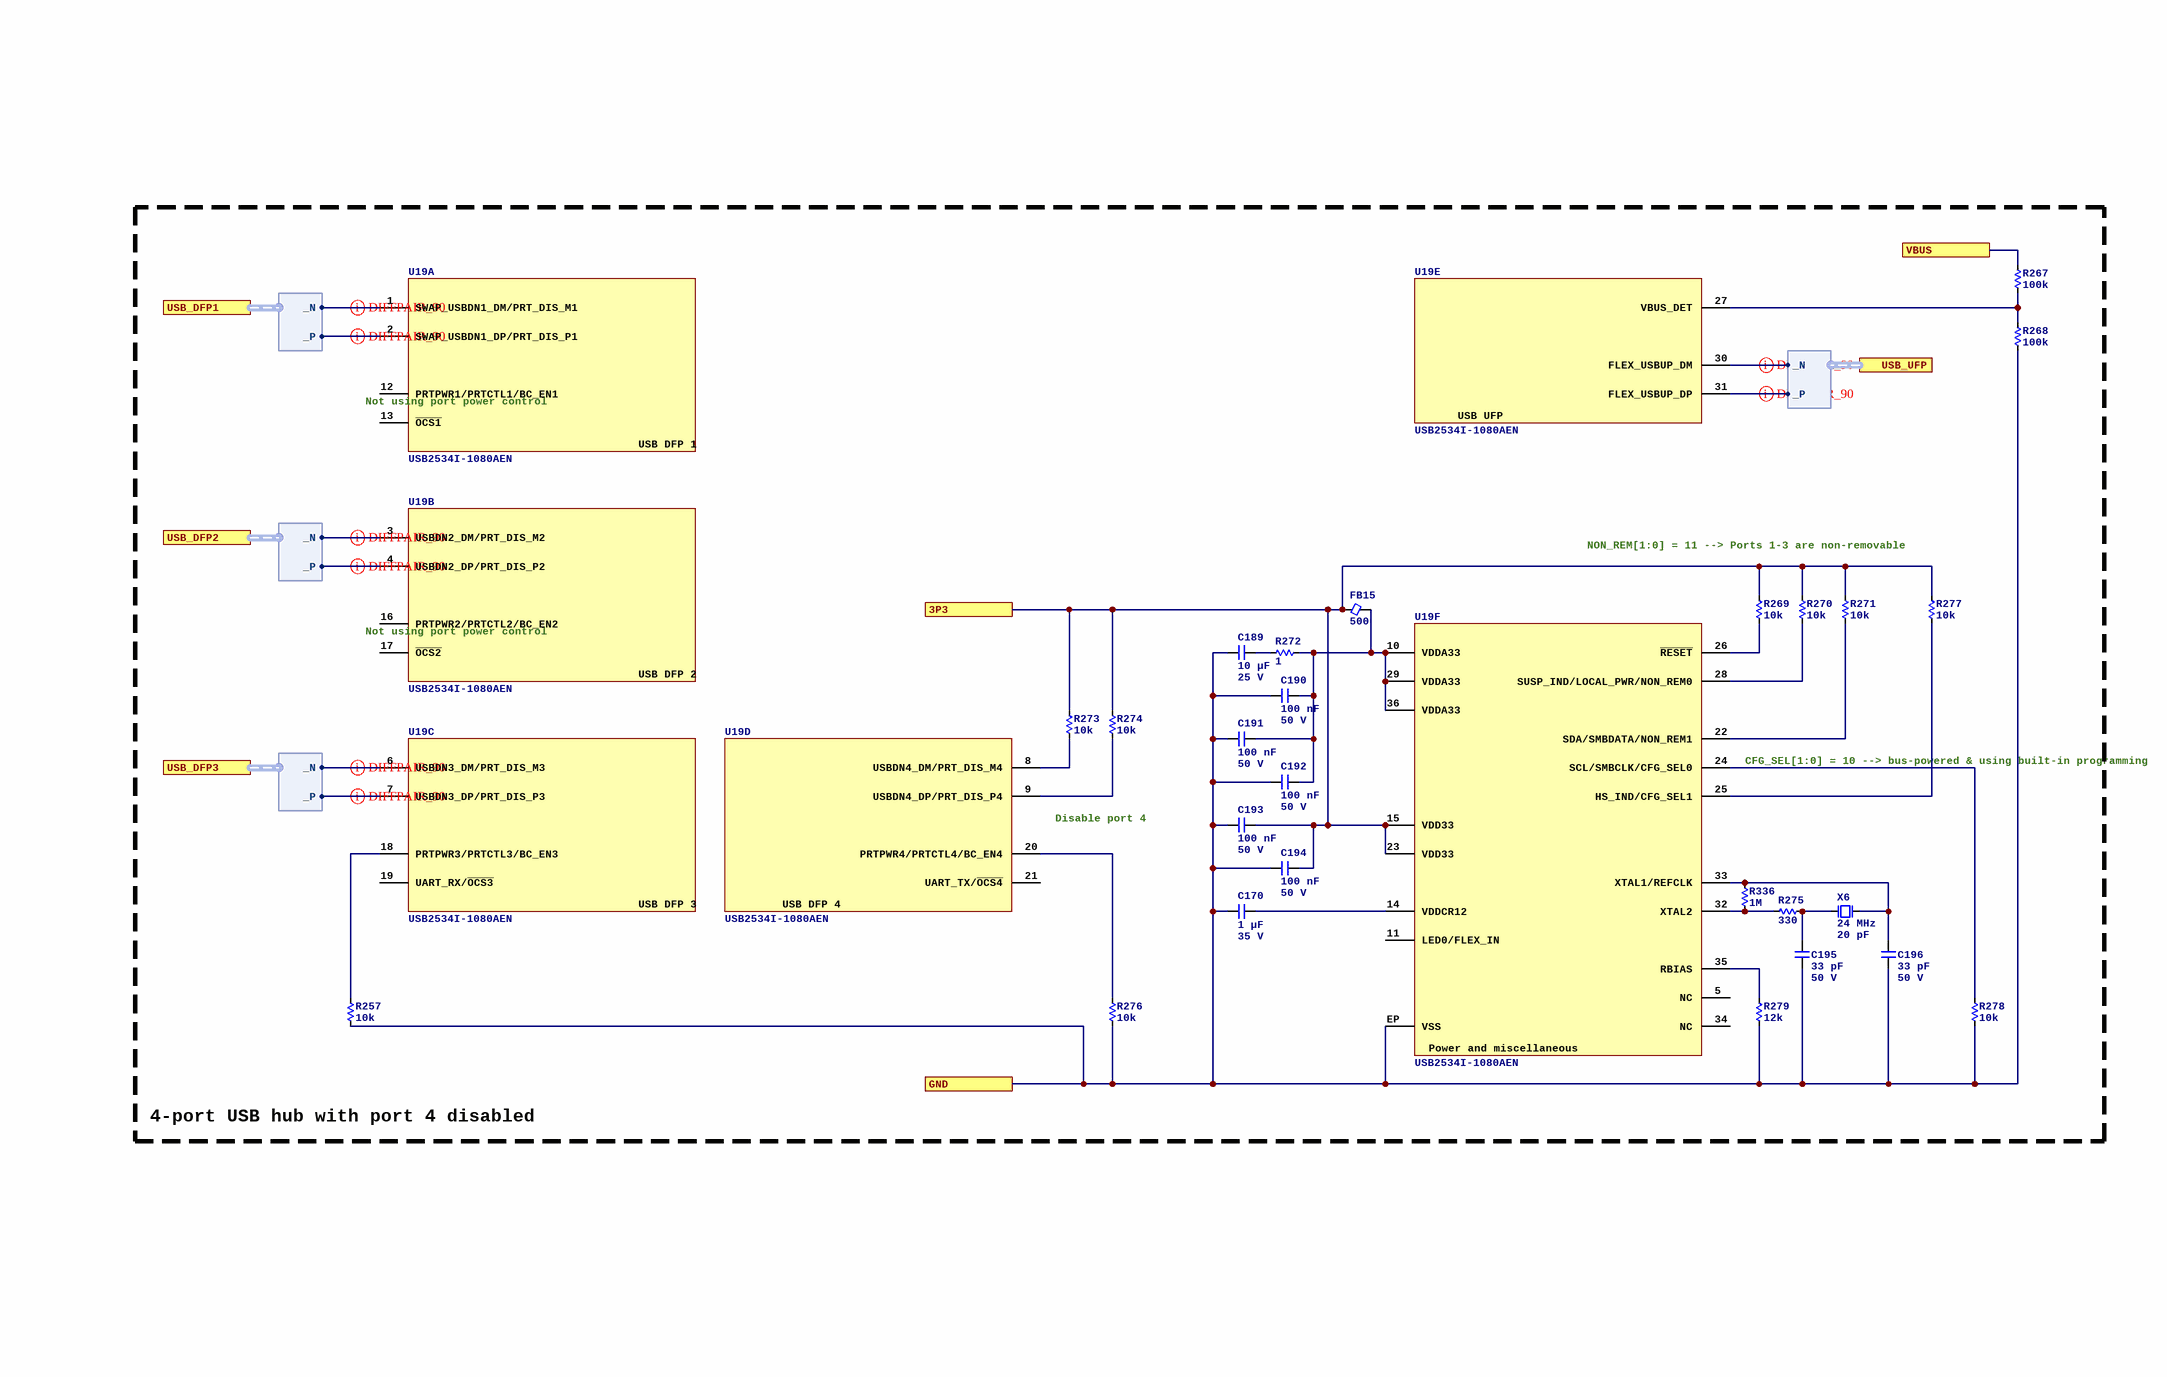
[diagram p23: usb_usb2534.SchDoc]

### Parts
C170  Capacitance: 1 µF  Voltage Rating: 35 V  [C0603]  (hidden comment: GMK107AB7105KAHT)
C189  Capacitance: 10 µF  Voltage Rating: 25 V  [C0805]  (hidden comment: CL21B106KAYQNNE)
C190  Capacitance: 100 nF  Voltage Rating: 50 V  [C0402]  (hidden comment: CL05B104KB54PNC)
C191  Capacitance: 100 nF  Voltage Rating: 50 V  [C0402]  (hidden comment: CL05B104KB54PNC)
C192  Capacitance: 100 nF  Voltage Rating: 50 V  [C0402]  (hidden comment: CL05B104KB54PNC)
C193  Capacitance: 100 nF  Voltage Rating: 50 V  [C0402]  (hidden comment: CL05B104KB54PNC)
C194  Capacitance: 100 nF  Voltage Rating: 50 V  [C0402]  (hidden comment: CL05B104KB54PNC)
C195  Capacitance: 33 pF  Voltage Rating: 50 V  [C0402]  (hidden comment: 0402CG330J500NT)
C196  Capacitance: 33 pF  Voltage Rating: 50 V  [C0402]  (hidden comment: 0402CG330J500NT)
FB15  Current Rating (mA): 500  [FB0402]  (hidden comment: BLM15AX601SN1D)
R257  value 10k  [R0402]  (hidden comment: 0402WGF1002TCE)
R267  value 100k  [R0402]  (hidden comment: 0402WGF1003TCE)
R268  value 100k  [R0402]  (hidden comment: 0402WGF1003TCE)
R269  value 10k  [R0402]  (hidden comment: 0402WGF1002TCE)
R270  value 10k  [R0402]  (hidden comment: 0402WGF1002TCE)
R271  value 10k  [R0402]  (hidden comment: 0402WGF1002TCE)
R272  value 1  [R0402]  (hidden comment: CRCW04021R00FKED)
R273  value 10k  [R0402]  (hidden comment: 0402WGF1002TCE)
R274  value 10k  [R0402]  (hidden comment: 0402WGF1002TCE)
R275  value 330  [R0402]  (hidden comment: 0402WGF3300TCE)
R276  value 10k  [R0402]  (hidden comment: 0402WGF1002TCE)
R277  value 10k  [R0402]  (hidden comment: 0402WGF1002TCE)
R278  value 10k  [R0402]  (hidden comment: 0402WGF1002TCE)
R279  value 12k  [R0402]  (hidden comment: 0402WGF1202TCE)
R336  value 1M  [R0402]  (hidden comment: 0402WGF1004TCE)
U19  USB2534I-1080AEN  [QFN50P600X600X90-36N]  (parts A,B,C,D,E,F of 6)
X6  Frequency: 24 MHz  Capacitance: 20 pF  [XTAL_TXC_7A]  (hidden comment: TAXM24M2QLFCDT1T)

### Ports
3P3, GND, USB_DFP1 (harness DIFF), USB_DFP2 (harness DIFF), USB_DFP3 (harness DIFF), USB_UFP (harness DIFF), VBUS

### Harnesses
DIFF: _N, _P

### Nets
3P3_USB: C193.1 C194.1 FB15.1 R269.1 R270.1 R271.1 R273.1 R274.1 R277.1 U19.15(VDD33) U19.23(VDD33) ; port 3P3
GND: C170.2 C189.2 C190.2 C191.2 C192.2 C193.2 C194.2 C195.2 C196.2 R257.2 R268.1 R276.2 R278.2 R279.2 U19.EP(VSS) ; port GND
VBUS: R267.1 ; port VBUS
USB_DFP1._N: U19.1(SWAP_USBDN1_DM/PRT_DIS_M1) ; port USB_DFP1._N
USB_DFP1._P: U19.2(SWAP_USBDN1_DP/PRT_DIS_P1) ; port USB_DFP1._P
USB_DFP2._N: U19.3(USBDN2_DM/PRT_DIS_M2) ; port USB_DFP2._N
USB_DFP2._P: U19.4(USBDN2_DP/PRT_DIS_P2) ; port USB_DFP2._P
USB_DFP3._N: U19.6(USBDN3_DM/PRT_DIS_M3) ; port USB_DFP3._N
USB_DFP3._P: U19.7(USBDN3_DP/PRT_DIS_P3) ; port USB_DFP3._P
USB_UFP._N: U19.30(FLEX_USBUP_DM) ; port USB_UFP._N
USB_UFP._P: U19.31(FLEX_USBUP_DP) ; port USB_UFP._P
NetC170_1: C170.1 U19.14(VDDCR12)
NetC189_1: C189.1 R272.2
NetC190_1: C190.1 C191.1 C192.1 FB15.2 R272.1 U19.10(VDDA33) U19.29(VDDA33) U19.36(VDDA33)
NetC195_1: C195.1 R275.1 X6.1
NetC196_1: C196.1 R336.1 U19.33(XTAL1/REFCLK) X6.2
NetR257_1: R257.1 U19.18(PRTPWR3/PRTCTL3/BC_EN3)
NetR267_2: R267.2 R268.2 U19.27(VBUS_DET)
NetR269_2: R269.2 U19.26(~{RESET})
NetR270_2: R270.2 U19.28(SUSP_IND/LOCAL_PWR/NON_REM0)
NetR271_2: R271.2 U19.22(SDA/SMBDATA/NON_REM1)
NetR273_2: R273.2 U19.8(USBDN4_DM/PRT_DIS_M4)
NetR274_2: R274.2 U19.9(USBDN4_DP/PRT_DIS_P4)
NetR275_2: R275.2 R336.2 U19.32(XTAL2)
NetR276_1: R276.1 U19.20(PRTPWR4/PRTCTL4/BC_EN4)
NetR277_2: R277.2 U19.25(HS_IND/CFG_SEL1)
NetR278_1: R278.1 U19.24(SCL/SMBCLK/CFG_SEL0)
NetR279_1: R279.1 U19.35(RBIAS)

Not connected (* = marked no-connect by the designer): U19 5(NC) 11(LED0/FLEX_IN) 12(PRTPWR1/PRTCTL1/BC_EN1) 13(~{OCS1}) 16(PRTPWR2/PRTCTL2/BC_EN2) 17(~{OCS2}) 19(UART_RX/~{OCS3}) 21(UART_TX/~{OCS4}) 34(NC)

### Layout directives
differential pair; differential pair class DE_90: USB_DFP1._N, USB_DFP1._P, USB_DFP2._N, USB_DFP2._P, USB_DFP3._N, USB_DFP3._P, USB_UFP._N, USB_UFP._P

### Notes on the sheet
- (near U19) Not using port power control
- NON_REM[1:0] = 11 --> Ports 1-3 are non-removable
- (near U19) Disable port 4
- (near U19) CFG_SEL[1:0] = 10 --> bus-powered & using built-in programming
- 4-port USB hub with port 4 disabled
- (in symbol USB2534I-1080AEN, part A) USB DFP 1
- (in symbol USB2534I-1080AEN, part B) USB DFP 2
- (in symbol USB2534I-1080AEN, part C) USB DFP 3
- (in symbol USB2534I-1080AEN, part D) USB DFP 4
- (in symbol USB2534I-1080AEN, part E) USB UFP
- (in symbol USB2534I-1080AEN, part F) Power and miscellaneous

### Library data of the parts
C170 = GMK107AB7105KAHT: as C175 on sheet conn_fan; ComponentLink1URL: https://datasheet.lcsc.com/lcsc/2304140030_Taiyo-Yuden-GMK107AB7105KAHT_C841050.pdf; ComponentLink1Description: Datasheet; Manufacturer Part Number: GMK107AB7105KAHT; Package: 0603; Supplier 2: LCSC; Supplier Part Number 2: C841050
C189 = CL21B106KAYQNNE: Manufacturer: Samsung Electro-Mechanics; Dielectric: X7R; ComponentLink1URL: https://datasheet.lcsc.com/lcsc/2206222030_Samsung-Electro-Mechanics-CL21B106KAYQNNE_C3039694.pdf; ComponentLink1Description: Datasheet; Manufacturer Part Number: CL21B106KAYQNNE; Package: 0805; Supplier 2: LCSC; Supplier Part Number 2: C3039694
C190-C194 = CL05B104KB54PNC: as C97 on sheet conn_fan; ComponentLink1URL: https://wmsc.lcsc.com/wmsc/upload/file/pdf/v2/lcsc/2304140030_Samsung-Electro-Mechanics-CL05B104KB54PNC_C307331.pdf; ComponentLink1Description: Datasheet; Manufacturer Part Number: CL05B104KB54PNC; Package: 0402; Supplier 2: LCSC; Supplier Part Number 2: C307331
C195 C196 = 0402CG330J500NT: Manufacturer: FH(Guangdong Fenghua Advanced Tech); Dielectric: C0G; ComponentLink1URL: https://wmsc.lcsc.com/wmsc/upload/file/pdf/v2/lcsc/2304140030_FH--Guangdong-Fenghua-Advanced-Tech-0402CG330J500NT_C1562.pdf; ComponentLink1Description: Datasheet; Manufacturer Part Number: 0402CG330J500NT; Package: 0402; Supplier 2: LCSC; Supplier Part Number 2: C1562
FB15 = BLM15AX601SN1D: Manufacturer: Murata Electronics; Z @ 100 MHz: 600; DCR (mOhms): 340; ComponentLink1URL: https://wmsc.lcsc.com/wmsc/upload/file/pdf/v2/lcsc/2304140030_Murata-Electronics-BLM15AX601SN1D_C76886.pdf; ComponentLink1Description: Datasheet; Manufacturer Part Number: BLM15AX601SN1D; Supplier 2: LCSC; Supplier Part Number 2: C76886; Package: 0402
R257 R269-R271 R273 R274 R276-R278 = 0402WGF1002TCE: as R115 on sheet conn_fan; ComponentLink1Description: Datasheet; ComponentLink1URL: https://wmsc.lcsc.com/wmsc/upload/file/pdf/v2/lcsc/2206010100_UNI-ROYAL-Uniroyal-Elec-0402WGF1002TCE_C25744.pdf; Manufacturer Part Number: 0402WGF1002TCE; Package: 0402; Supplier 2: LCSC; Supplier Part Number 2: C25744
R267 R268 = 0402WGF1003TCE: as R141 on sheet current_mp6519; ComponentLink1Description: Datasheet; ComponentLink1URL: https://wmsc.lcsc.com/wmsc/upload/file/pdf/v2/lcsc/2206010100_UNI-ROYAL-Uniroyal-Elec-0402WGF1003TCE_C25741.pdf; Manufacturer Part Number: 0402WGF1003TCE; Package: 0402; Supplier 2: LCSC; Supplier Part Number 2: C25741
R272 = CRCW04021R00FKED: Manufacturer: Vishay Intertech; Tolerance: 1%; Temperature Coefficient: ±100ppm/?; Power Rating (mW): 63; ComponentLink1Description: Datasheet; ComponentLink1URL: https://wmsc.lcsc.com/wmsc/upload/file/pdf/v2/lcsc/2211030200_Vishay-Intertech-CRCW04021R00FKED_C482087.pdf; Manufacturer Part Number: CRCW04021R00FKED; Package: 0402; Supplier 2: LCSC; Supplier Part Number 2: C482087
R275 = 0402WGF3300TCE: Manufacturer: UNI-ROYAL(Uniroyal Elec); Tolerance: 1%; Temperature Coefficient: ±100ppm/?; Power Rating (mW): 62.5; ComponentLink1Description: Datasheet; ComponentLink1URL: https://wmsc.lcsc.com/wmsc/upload/file/pdf/v2/lcsc/2205311900_UNI-ROYAL-Uniroyal-Elec-0402WGF3300TCE_C25104.pdf; Manufacturer Part Number: 0402WGF3300TCE; Package: 0402; Supplier 2: LCSC; Supplier Part Number 2: C25104
R279 = 0402WGF1202TCE: Manufacturer: UNI-ROYAL(Uniroyal Elec); Tolerance: 1%; Temperature Coefficient: ±100ppm/?; Power Rating (mW): 62.5; ComponentLink1Description: Datasheet; ComponentLink1URL: https://wmsc.lcsc.com/wmsc/upload/file/pdf/v2/lcsc/2411221127_UNI-ROYAL-Uniroyal-Elec-0402WGF1202TCE_C25752.pdf; Manufacturer Part Number: 0402WGF1202TCE; Package: 0402; Supplier 2: LCSC; Supplier Part Number 2: C25752
R336 = 0402WGF1004TCE: Manufacturer: UNI-ROYAL(Uniroyal Elec); Tolerance: 1%; Temperature Coefficient: ±100ppm/?; Power Rating (mW): 62.5; ComponentLink1Description: Datasheet; ComponentLink1URL: https://wmsc.lcsc.com/wmsc/upload/file/pdf/v2/lcsc/2206010030_UNI-ROYAL-Uniroyal-Elec-0402WGF1004TCE_C26083.pdf; Manufacturer Part Number: 0402WGF1004TCE; Package: 0402; Supplier 2: LCSC; Supplier Part Number 2: C26083
U19 = USB2534I-1080AEN: USB Bus Controller, CMOS; Manufacturer: Microchip; Supplier 1: DigiKey; Supplier Part Number 1: USB2534I-1080AEN-ND; Manufacturer Part Number: USB2534I-1080AEN; ComponentLink1Description: Datasheet; ComponentLink1URL: https://ww1.microchip.com/downloads/aemDocuments/documents/UNG/ProductDocuments/DataSheets/USB2534-Data-Sheet-DS00001713.pdf; ComponentLink2Description: Product page; ComponentLink2URL: https://www.microchip.com/en-us/product/USB2534; Supplier 2: LCSC; Supplier Part Number 2: C626674; Supplier 3: Mouser; Supplier Part Number 3: 579-USB2534I-1080AEN
X6 = TAXM24M2QLFCDT1T: CRYSTAL 24.000 MHZ 20PF SMD; Manufacturer: Yajingxin; ComponentLink1URL: http://www.txccrystal.com/images/pdf/7a.pdf; ComponentLink1Description: Datasheet; Manufacturer Part Number: TAXM24M2QLFCDT1T; Supplier 2: LCSC; Supplier Part Number 2: C122520

## Sheet conn_usbc.SchDoc
size A
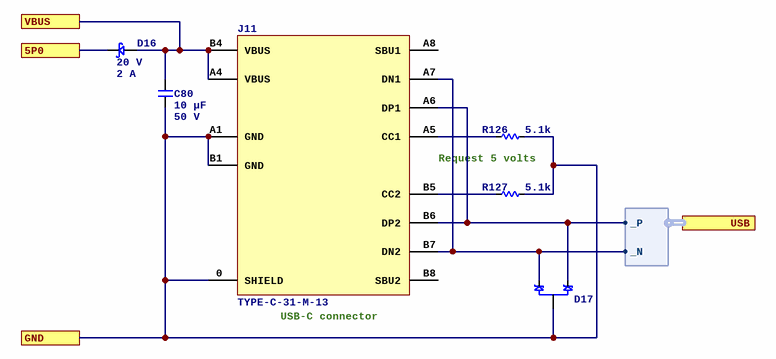
[diagram p24: conn_usbc.SchDoc]

### Parts
C80  Capacitance: 10 µF  Voltage Rating: 50 V  [C1206]  (hidden comment: CL31B106KBHNNNE)
D16  Vr: 20 V  Current: 2 A  [ESMP]  (hidden comment: MSS2P2-M3/89A)
D17  PESD2USB3UX  [3SOT23]  (value not drawn)
J11  TYPE-C-31-M-13  [CONN_USBC_TYPE-C-31-M-13]
R126  value 5.1k  [R0402]  (hidden comment: 0402WGF5101TCE)
R127  value 5.1k  [R0402]  (hidden comment: 0402WGF5101TCE)

### Ports
5P0, GND, USB (harness DIFF), VBUS

### Harnesses
DIFF: _P, _N

### Nets
5P0: D16.2 ; port 5P0
GND: C80.2 D17.3 J11.0(SHIELD) J11.A1(GND) J11.B1(GND) R126.1 R127.1 ; port GND
VBUS: C80.1 D16.1 J11.A4(VBUS) J11.B4(VBUS) ; port VBUS
USB_UFP._N: D17.1 J11.A7(DN1) J11.B7(DN2) ; port USB._N
USB_UFP._P: D17.2 J11.A6(DP1) J11.B6(DP2) ; port USB._P
NetJ11_A5: J11.A5(CC1) R126.2
NetJ11_B5: J11.B5(CC2) R127.2

Not connected (* = marked no-connect by the designer): J11 A8(SBU1) B8(SBU2)

### Notes on the sheet
- Request 5 volts
- (near J11) USB-C connector

### Library data of the parts
C80 = CL31B106KBHNNNE: Manufacturer: Samsung Electro-Mechanics; Dielectric: X7R; ComponentLink1URL: https://wmsc.lcsc.com/wmsc/upload/file/pdf/v2/lcsc/1810221111_Samsung-Electro-Mechanics-CL31B106KBHNNNE_C89632.pdf; ComponentLink1Description: Datasheet; Manufacturer Part Number: CL31B106KBHNNNE; Package: 1206; Supplier 2: LCSC; Supplier Part Number 2: C89632
D16 = MSS2P2-M3/89A: as D20 on sheet current_mp6519; Supplier 1: DigiKey; Manufacturer Part Number: MSS2P2-M3/89A; ComponentLink1URL: http://www.vishay.com/docs/89054/mss2p3.pdf; ComponentLink1Description: Datasheet; Supplier Part Number 1: MSS2P2-M3/89AGICT-ND; Supplier 2: LCSC; Supplier Part Number 2: C2978531; Diode Type: Schottky; Supplier 3: Mouser; Supplier Part Number 3: 625-MSS2P2-M3
D17 = PESD2USB3UX: DIODE ESD USB SOT-23; Manufacturer: Nexperia USA Inc.; Polarity: Unidirectional; Capacitance (pF): 0.7; Standoff (V): 3.3; Min Breakdown Voltage: 4.2 V; Supplier 1: DigiKey; Supplier Part Number 1: 1727-PESD2USB3UX-CT-ND; Manufacturer Part Number: PESD2USB3UX; Supplier 2: LCSC; Supplier Part Number 2: C3708426; ComponentLink1Description: Datasheet; ComponentLink1URL: https://assets.nexperia.com/documents/data-sheet/PESD2USB3UX-T.pdf; Supplier 3: Mouser; Supplier Part Number 3: 771-PESD2USB3UX-TR
J11 = TYPE-C-31-M-13: USB 2.0 12P USB-C connector; Manufacturer: HRO Electronics; Manufacturer Part Number: TYPE-C-31-M-13; Supplier 2: LCSC; Supplier Part Number 2: C223906; ComponentLink1Description: Datasheet; ComponentLink1URL: https://www.lcsc.com/datasheet/C223906.pdf
R126 R127 = 0402WGF5101TCE: Manufacturer: UNI-ROYAL(Uniroyal Elec); Tolerance: 1%; Temperature Coefficient: ±100ppm/?; Power Rating (mW): 62.5; ComponentLink1Description: Datasheet; ComponentLink1URL: https://wmsc.lcsc.com/wmsc/upload/file/pdf/v2/lcsc/2206010045_UNI-ROYAL-Uniroyal-Elec-0402WGF5101TCE_C25905.pdf; Manufacturer Part Number: 0402WGF5101TCE; Package: 0402; Supplier 2: LCSC; Supplier Part Number 2: C25905